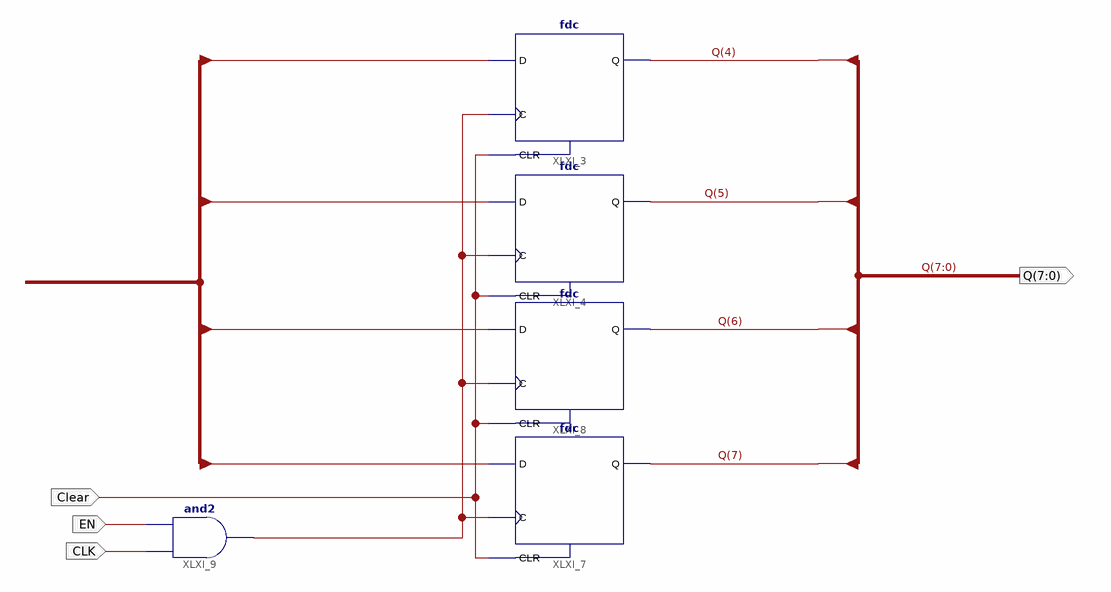
[diagram p0: schematic sheet 1]
// Xilinx ISE schematic Reg_8.sch (spartan3e) as structural Verilog: 5 symbols, 4 ports
module Reg_8 (
  input  CLK,
  input  EN,
  input  Clear,
  output [7:0] Q
);

  wire XLXN_13, XLXN_19, XLXN_20, XLXN_21;
  wire [0:0] D;

  fdc XLXI_3 (.C(XLXN_13), .CLR(Clear), .D(D[0]), .Q(Q[4]));
  fdc XLXI_4 (.C(XLXN_13), .CLR(Clear), .D(XLXN_19), .Q(Q[5]));
  fdc XLXI_7 (.C(XLXN_13), .CLR(Clear), .D(XLXN_21), .Q(Q[7]));
  fdc XLXI_8 (.C(XLXN_13), .CLR(Clear), .D(XLXN_20), .Q(Q[6]));
  and XLXI_9 (XLXN_13, CLK, EN);
endmodule
